# Altium project RFCU_V2.0.PrjPcb
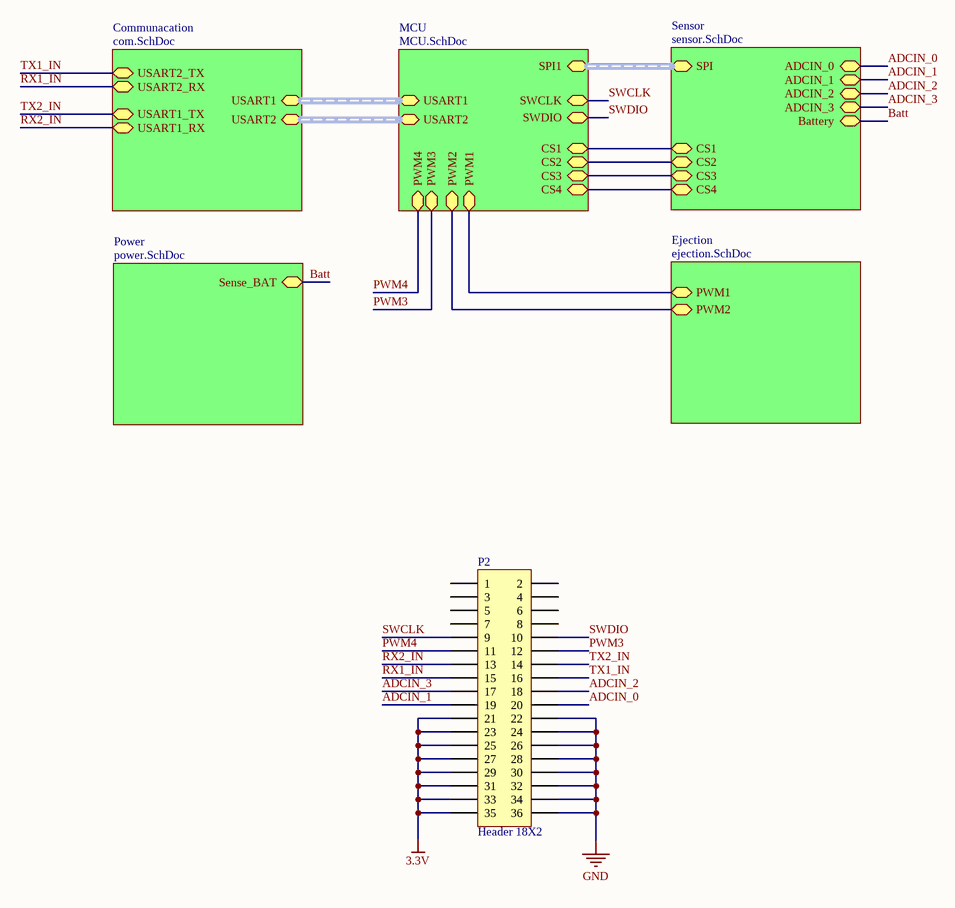
[diagram p0: RFCU_V2.0.SchDoc]
6 sheets, 68 parts. Net scope: hierarchical (ports join the sheet entries above them; power ports are global).
Board file: RCFU_V2.0.PcbDoc
Sheets:
  RFCU_V2.0.SchDoc
    MCU = MCU.SchDoc
    Power = power.SchDoc
    Sensor = sensor.SchDoc
    Communacation = com.SchDoc
    Ejection = ejection.SchDoc

## Sheet RFCU_V2.0.SchDoc
size A4

### Parts
P2  Header 18X2  [2X18 2.54mm Headers]

### Sub-sheets
Communacation = com.SchDoc: USART1 (harness USART), USART2 (harness USART), USART2_RX, USART2_TX, USART1_TX, USART1_RX
Ejection = ejection.SchDoc: PWM2, PWM1
MCU = MCU.SchDoc: USART1 (harness USART), USART2 (harness USART), SPI1 (harness SPI), PWM3, PWM4, PWM2, PWM1, SWCLK, SWDIO, CS4, CS3, CS1, CS2
Power = power.SchDoc: Sense_BAT
Sensor = sensor.SchDoc: SPI (harness SPI), ADCIN_2, ADCIN_1, ADCIN_3, ADCIN_0, Battery, CS2, CS1, CS4, CS3

### Nets
3.3V: P2.21 P2.23 P2.25 P2.27 P2.29 P2.31 P2.33 P2.35  [project net VDD1]
GND: P2.22 P2.24 P2.26 P2.28 P2.30 P2.32 P2.34 P2.36  [project net VSS1]
ADCIN_0: P2.20 ; sheet Sensor/ADCIN_0
ADCIN_1: P2.19 ; sheet Sensor/ADCIN_1
ADCIN_2: P2.18 ; sheet Sensor/ADCIN_2
ADCIN_3: P2.17 ; sheet Sensor/ADCIN_3
Batt: sheet Power/Sense_BAT, sheet Sensor/Battery
CS1: sheet MCU/CS1, sheet Sensor/CS1
CS2: sheet MCU/CS2, sheet Sensor/CS2
CS3: sheet MCU/CS3, sheet Sensor/CS3
CS4: sheet MCU/CS4, sheet Sensor/CS4
PWM3: P2.12 ; sheet MCU/PWM3
PWM4: P2.11 ; sheet MCU/PWM4
RX1_IN: P2.15 ; sheet Communacation/USART2_RX
RX2_IN: P2.13 ; sheet Communacation/USART1_RX
SWCLK: P2.9 ; sheet MCU/SWCLK
SWDIO: P2.10 ; sheet MCU/SWDIO
TX1_IN: P2.16 ; sheet Communacation/USART2_TX
TX2_IN: P2.14 ; sheet Communacation/USART1_TX
NetU1_31: sheet MCU/PWM2, sheet Ejection/PWM2
NetU1_32: sheet MCU/PWM1, sheet Ejection/PWM1

Not connected (* = marked no-connect by the designer): P2 1 2 3 4 5 6 7 8

### Buses and harness runs
harness sheet Communacation/USART1 = sheet MCU/USART1
harness sheet Communacation/USART2 = sheet MCU/USART2
harness sheet MCU/SPI1 = sheet Sensor/SPI

### Library data of the parts
P2 = Header 18X2: Header, 18-Pin, Dual row; LatestRevisionDate: 17-Jul-2002; LatestRevisionNote: Re-released for DXP Platform.; Publisher: Altium Limited

## Sheet MCU.SchDoc
size A4
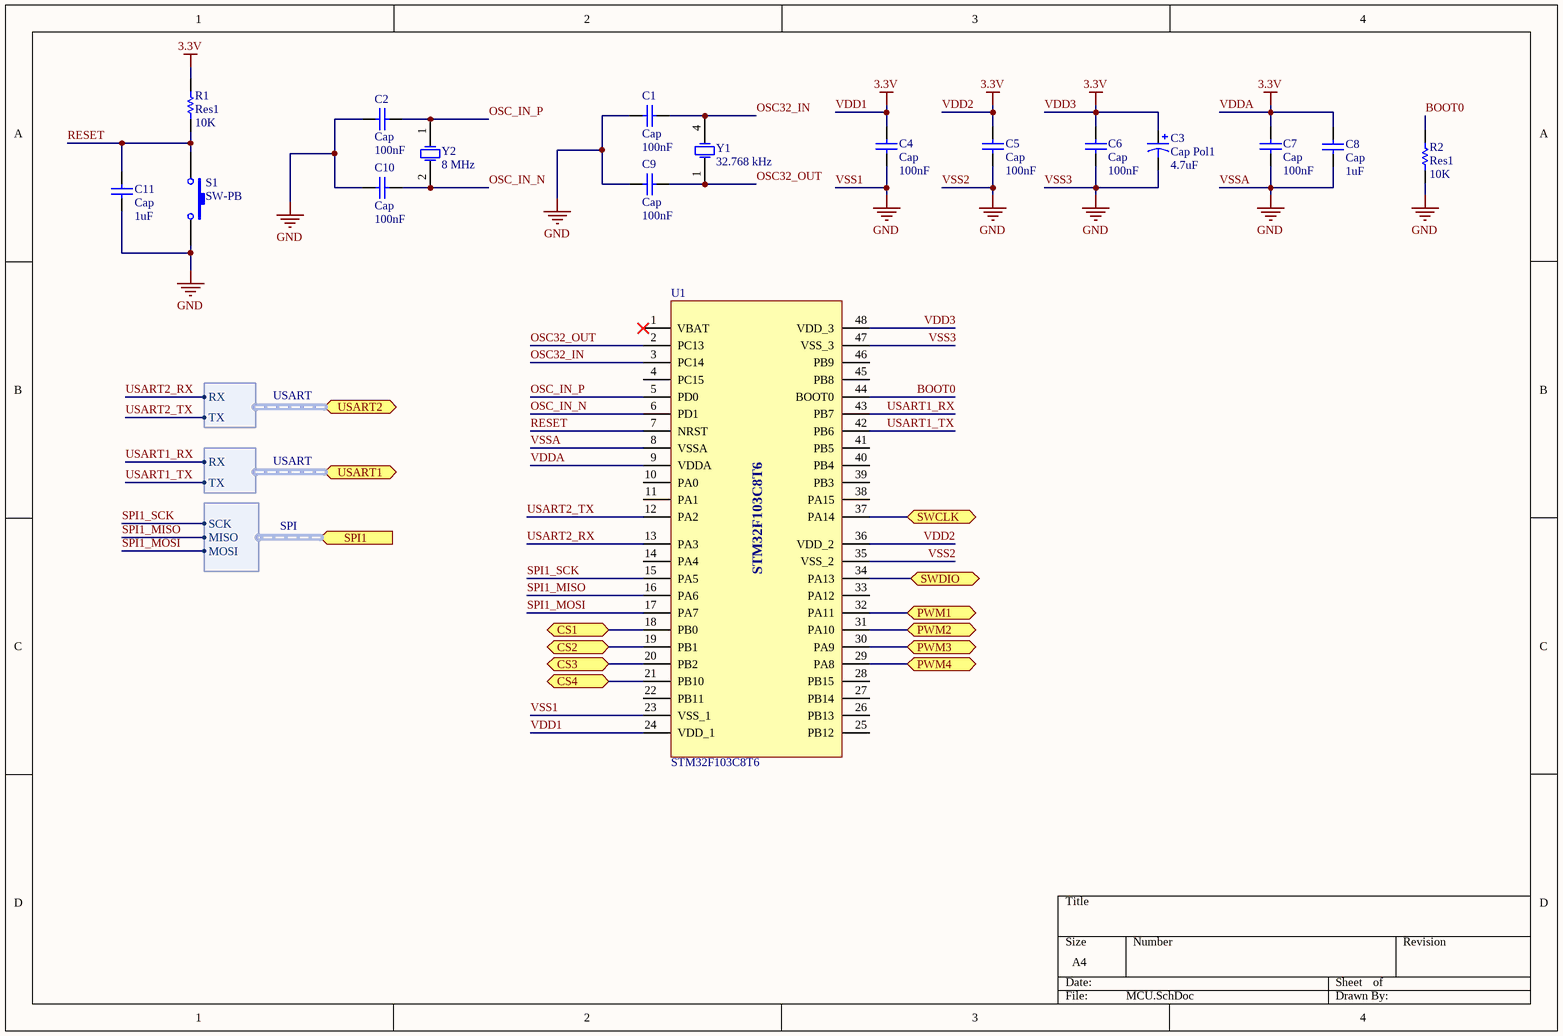
[diagram p1: MCU.SchDoc]

### Parts
C1  Cap  value 100nF  [0805-CAP]
C2  Cap  value 100nF  [0805-CAP]
C3  Cap Pol1  value 4.7uF  [Tantalum A-Case]
C4  Cap  value 100nF  [0805-CAP]
C5  Cap  value 100nF  [0805-CAP]
C6  Cap  value 100nF  [0805-CAP]
C7  Cap  value 100nF  [0805-CAP]
C8  Cap  value 1uF  [0805-CAP]
C9  Cap  value 100nF  [0805-CAP]
C10  Cap  value 100nF  [0805-CAP]
C11  Cap  value 1uF  [0805-CAP]
R1  Res1  value 10K  [0805-RES]
R2  Res1  value 10K  [0805-RES]
S1  SW-PB  [3x6x2.5mm Tacticle Push Button]
U1  STM32F103C8T6  [LQFP-48]
Y1  32.768 kHz  [MC-306 SMD]
Y2  8 MHz  [HC49 Crystal SMD]

### Ports
CS1, CS2, CS3, CS4, PWM1, PWM2, PWM3, PWM4, SPI1 (harness SPI), SWCLK, SWDIO, USART1 (harness USART), USART2 (harness USART)

### Harnesses
USART: TX, RX
SPI: SCK, MISO, MOSI

### Nets
VDD1: C3.1 C4.2 C5.2 C6.2 C7.2 C8.2 R1.2 U1.9(VDDA) U1.24(VDD_1) U1.36(VDD_2) U1.48(VDD_3)  [also labelled 3.3V, VDD2, VDD3, VDDA]
VSS1: C1.2 C2.2 C3.2 C4.1 C5.1 C6.1 C7.1 C8.1 C9.2 C10.2 C11.1 R2.1 S1.2 U1.8(VSSA) U1.23(VSS_1) U1.35(VSS_2) U1.47(VSS_3)  [also labelled GND, VSS2, VSS3, VSSA]
BOOT0: R2.2 U1.44(BOOT0)
CS1: U1.18(PB0) ; port CS1
CS2: U1.19(PB1) ; port CS2
CS3: U1.20(PB2) ; port CS3
CS4: U1.21(PB10) ; port CS4
OSC32_IN: C1.1 U1.3(PC14) Y1.4(OSC2)
OSC32_OUT: C9.1 U1.2(PC13) Y1.1(OSC1)
OSC_IN_N: C10.1 U1.6(PD1) Y2.2(OSC2)
OSC_IN_P: C2.1 U1.5(PD0) Y2.1(OSC1)
PWM3: U1.30(PA9) ; port PWM3
PWM4: U1.29(PA8) ; port PWM4
RESET: C11.2 R1.1 S1.1 U1.7(NRST)
SPI1_MISO: U1.16(PA6) ; port SPI1.MISO  [project net MISO]
SPI1_MOSI: U1.17(PA7) ; port SPI1.MOSI  [project net MOSI]
SPI1_SCK: U1.15(PA5) ; port SPI1.SCK  [project net SCK]
SWCLK: U1.37(PA14) ; port SWCLK
SWDIO: U1.34(PA13) ; port SWDIO
USART1_RX: U1.43(PB7) ; port USART1.RX  [project net RX2_IN]
USART1_TX: U1.42(PB6) ; port USART1.TX  [project net TX2_IN]
USART2_RX: U1.13(PA3) ; port USART2.RX  [project net RX1_IN]
USART2_TX: U1.12(PA2) ; port USART2.TX  [project net TX1_IN]
NetU1_31: U1.31(PA10) ; port PWM2
NetU1_32: U1.32(PA11) ; port PWM1

Not connected (* = marked no-connect by the designer): U1 1(VBAT)* 4(PC15) 10(PA0) 11(PA1) 14(PA4) 22(PB11) 25(PB12) 26(PB13) 27(PB14) 28(PB15) 33(PA12) 38(PA15) 39(PB3) 40(PB4) 41(PB5) 45(PB8) 46(PB9)

### Library data of the parts
C1 C2 C4-C11 = Cap: Capacitor; Published: 8-Jun-2000; LatestRevisionDate: 17-Jul-2002; LatestRevisionNote: Re-released for DXP Platform.; PackageReference: RAD-0.3; Publisher: Altium Limited; PackageDescription: Radial Cap, Thru-Hole; 2 Leads; 0.3 in Pin Spacing
C3 = Cap Pol1: Polarized Capacitor (Radial); Published: 8-Jun-2000; LatestRevisionDate: 17-Jul-2002; LatestRevisionNote: Re-released for DXP Platform.; PackageReference: RB7.6-15; Publisher: Altium Limited; PackageDescription: Polarized Capacitor (Radial); 2 Leads
R1 R2 = Res1: Resistor; Published: 8-Jun-2000; LatestRevisionDate: 17-Jul-2002; LatestRevisionNote: Re-released for DXP Platform.; PackageReference: AXIAL-0.3; Publisher: Altium Limited; PackageDescription: Axial Device, Thru-Hole; 2 Leads; 0.3 in Pin Spacing
S1 = SW-PB: Switch; Published: 24-Mar-1999; LatestRevisionDate: 17-Jul-2002; LatestRevisionNote: Re-released for DXP Platform.; PackageReference: SPST-2; Publisher: Altium Limited; PackageDescription: Switch; 2 Leads
U1 = STM32F103C8T6-LQPF48: STM32F103C8T6 LQPF-48
Y1 Y2 = XTAL: Crystal Oscillator; Published: 8-Jun-2000; LatestRevisionDate: 17-Jul-2002; LatestRevisionNote: Re-released for DXP Platform.; PackageReference: R38; Publisher: Altium Limited; PackageDescription: Crystal, Thru-Hole; 2 Leads; Body 3.1 x 8.2 mm (Dia.xH)

## Sheet power.SchDoc
size A4
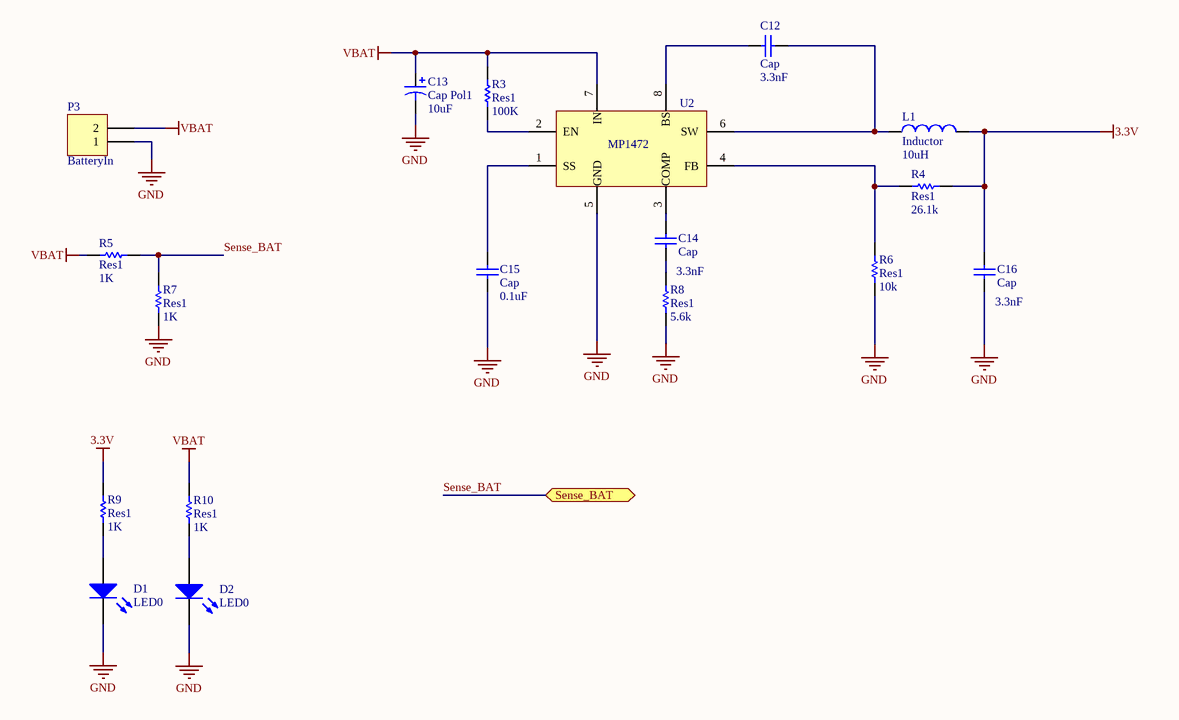
[diagram p2: power.SchDoc]

### Parts
C12  Cap  value 3.3nF  [0805-CAP]
C13  Cap Pol1  value 10uF  [Tantalum A-Case]
C14  Cap  value 3.3nF  [0805-CAP]
C15  Cap  value 0.1uF  [0805-CAP]
C16  Cap  value 3.3nF  [0805-CAP]
D1  LED0  [1206-LED RED]
D2  LED0  [1206-LED RED]
L1  Inductor  value 10uH  [DR125]
P3  BatteryIn  [Battery 1]
R3  Res1  value 100K  [0805-RES]
R4  Res1  value 26.1k  [0805-RES]
R5  Res1  value 1K  [0805-RES]
R6  Res1  value 10k  [0805-RES]
R7  Res1  value 1K  [0805-RES]
R8  Res1  value 5.6k  [0805-RES]
R9  Res1  value 1K  [0805-RES]
R10  Res1  value 1K  [0805-RES]
U2  MP1472  [TSOP-23]

### Ports
Sense_BAT

### Nets
3.3V: C16.1 L1.2 R4.2 R9.2  [project net VDD1]
GND: C13.2 C15.2 C16.2 D1.2(K) D2.2(K) P3.1 R6.1 R7.2 R8.2 U2.5(GND)  [project net VSS1]
VBAT: C13.1 P3.2 R3.1 R5.1 R10.2 U2.7(IN)  [project net LoadIN]
Sense_BAT: R5.2 R7.1 ; port Sense_BAT  [project net Batt]
NetC12_1: C12.1 U2.8(BS)
NetC12_2: C12.2 L1.1 U2.6(SW)
NetC14_1: C14.1 U2.3(COMP)
NetC14_2: C14.2 R8.1
NetC15_1: C15.1 U2.1(SS)
NetD1_1: D1.1(A) R9.1
NetD2_1: D2.1(A) R10.1
NetR3_2: R3.2 U2.2(EN)
NetR4_1: R4.1 R6.2 U2.4(FB)

### Library data of the parts
C12 C14-C16 = Cap: Capacitor; Published: 8-Jun-2000; LatestRevisionDate: 17-Jul-2002; LatestRevisionNote: Re-released for DXP Platform.; PackageReference: RAD-0.3; Publisher: Altium Limited; PackageDescription: Radial Cap, Thru-Hole; 2 Leads; 0.3 in Pin Spacing
C13 = Cap Pol1: Polarized Capacitor (Radial); Published: 8-Jun-2000; LatestRevisionDate: 17-Jul-2002; LatestRevisionNote: Re-released for DXP Platform.; PackageReference: RB7.6-15; Publisher: Altium Limited; PackageDescription: Polarized Capacitor (Radial); 2 Leads
D1 D2 = LED0: Typical INFRARED GaAs LED; Published: 8-Jun-2000; LatestRevisionDate: 08-Jul-2005; LatestRevisionNote: Mech Layer 1 removed.; PackageReference: LED-0; Publisher: Altium Limited; PackageDescription: LED; 2 Leads
L1 = Inductor: Code_IEC: 1005; Published: 8-Jun-2000; LatestRevisionDate: 29-May-2009; LatestRevisionNote: IPC-7351 Footprint Added.; PackageReference: 0402-A; Publisher: Altium Limited; PackageDescription: Chip Inductor; Code_JEITA: 0402
P3 = Header 2: Header, 2-Pin; LatestRevisionDate: 17-Jul-2002; LatestRevisionNote: Re-released for DXP Platform.; Publisher: Altium Limited
R3-R10 = Res1: Resistor; Published: 8-Jun-2000; LatestRevisionDate: 17-Jul-2002; LatestRevisionNote: Re-released for DXP Platform.; PackageReference: AXIAL-0.3; Publisher: Altium Limited; PackageDescription: Axial Device, Thru-Hole; 2 Leads; 0.3 in Pin Spacing
U2 = MP1472: MP1472 2A 18V Step-Down Conventor

## Sheet sensor.SchDoc
size A4
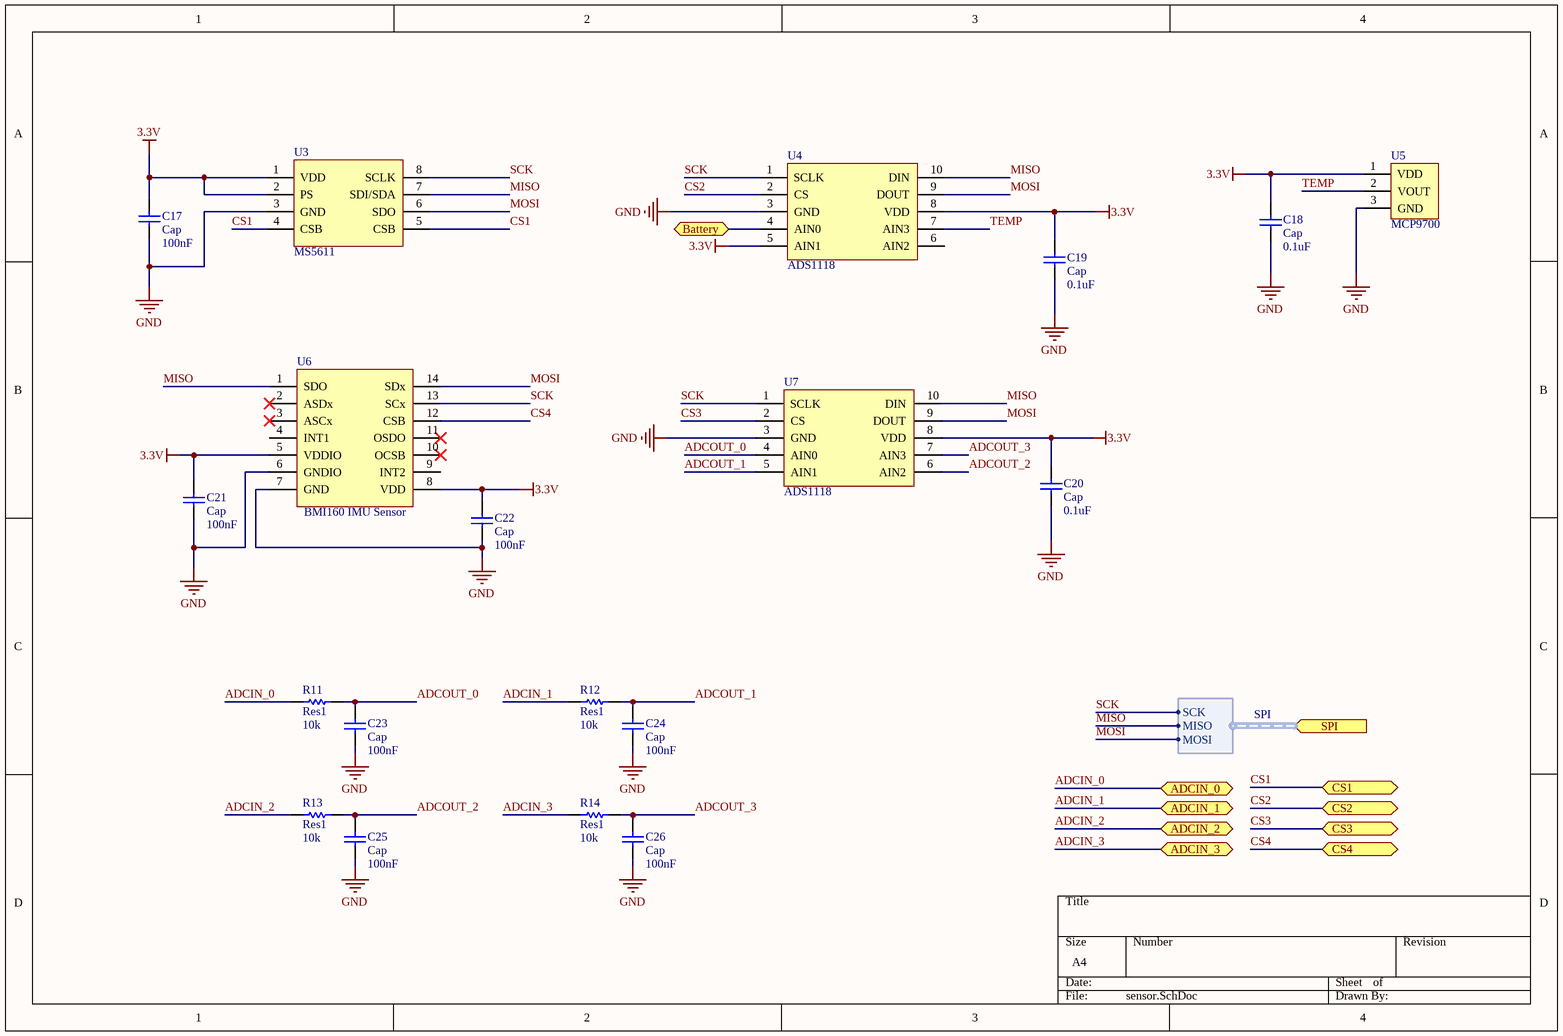
[diagram p3: sensor.SchDoc]

### Parts
C17  Cap  value 100nF  [0805-CAP]
C18  Cap  value 0.1uF  [0805-CAP]
C19  Cap  value 0.1uF  [0805-CAP]
C20  Cap  value 0.1uF  [0805-CAP]
C21  Cap  value 100nF  [0805-CAP]
C22  Cap  value 100nF  [0805-CAP]
C23  Cap  value 100nF  [0805-CAP]
C24  Cap  value 100nF  [0805-CAP]
C25  Cap  value 100nF  [0805-CAP]
C26  Cap  value 100nF  [0805-CAP]
R11  Res1  value 10k  [0805-RES]
R12  Res1  value 10k  [0805-RES]
R13  Res1  value 10k  [0805-RES]
R14  Res1  value 10k  [0805-RES]
U3  MS5611  [MS5611-01BA03]
U4  ADS1118  [MSOP10]
U5  MCP9700  [SOT23-3 (TO-236AB)]
U6  BMI160 IMU Sensor  [BMI160]
U7  ADS1118  [MSOP10]

### Ports
ADCIN_0, ADCIN_1, ADCIN_2, ADCIN_3, Battery, CS1, CS2, CS3, CS4, SPI (harness SPI)

### Harnesses
SPI: SCK, MISO, MOSI

### Nets
3.3V: C17.1 C18.1 C19.1 C20.1 C21.1 C22.1 U3.1(VDD) U3.2(PS) U4.5(AIN1) U4.8(VDD) U5.1(VDD) U6.5(VDDIO) U6.8(VDD) U7.8(VDD)  [project net VDD1]
GND: C17.2 C18.2 C19.2 C20.2 C21.2 C22.2 C23.2 C24.2 C25.2 C26.2 U3.3(GND) U4.3(GND) U5.3(GND) U6.6(GNDIO) U6.7(GND) U7.3(GND)  [project net VSS1]
ADCIN_0: R11.1 ; port ADCIN_0
ADCIN_1: R12.1 ; port ADCIN_1
ADCIN_2: R13.1 ; port ADCIN_2
ADCIN_3: R14.1 ; port ADCIN_3
ADCOUT_0: C23.1 R11.2 U7.4(AIN0)
ADCOUT_1: C24.1 R12.2 U7.5(AIN1)
ADCOUT_2: C25.1 R13.2 U7.6(AIN2)
ADCOUT_3: C26.1 R14.2 U7.7(AIN3)
Batt: U4.4(AIN0) ; port Battery
CS1: U3.4(CSB) U3.5(CSB) ; port CS1
CS2: U4.2(CS) ; port CS2
CS3: U7.2(CS) ; port CS3
CS4: U6.12(CSB) ; port CS4
MISO: U3.7(SDI/SDA) U4.10(DIN) U6.1(SDO) U7.10(DIN) ; port SPI.MISO
MOSI: U3.6(SDO) U4.9(DOUT) U6.14(SDx) U7.9(DOUT) ; port SPI.MOSI
SCK: U3.8(SCLK) U4.1(SCLK) U6.13(SCx) U7.1(SCLK) ; port SPI.SCK
TEMP: U4.7(AIN3) U5.2(VOUT)

Not connected (* = marked no-connect by the designer): U4 6(AIN2); U6 2(ASDx)* 3(ASCx)* 4(INT1) 9(INT2) 10(OCSB)* 11(OSDO)*

### Library data of the parts
C17-C26 = Cap: Capacitor; Published: 8-Jun-2000; LatestRevisionDate: 17-Jul-2002; LatestRevisionNote: Re-released for DXP Platform.; PackageReference: RAD-0.3; Publisher: Altium Limited; PackageDescription: Radial Cap, Thru-Hole; 2 Leads; 0.3 in Pin Spacing
R11-R14 = Res1: Resistor; Published: 8-Jun-2000; LatestRevisionDate: 17-Jul-2002; LatestRevisionNote: Re-released for DXP Platform.; PackageReference: AXIAL-0.3; Publisher: Altium Limited; PackageDescription: Axial Device, Thru-Hole; 2 Leads; 0.3 in Pin Spacing
U3 = MS5611: MS5611 Barometer I2C/SPI
U4 U7 = ADS1118: ADS1118 SPI 4 Channel ADC
U5 = MCP9700: MCP9700 Linear Temperature Sensor
U6 = BMI160 IMU Sensor: BoschTech BMI160 6 Axis IMU Sensor

## Sheet com.SchDoc
size A4
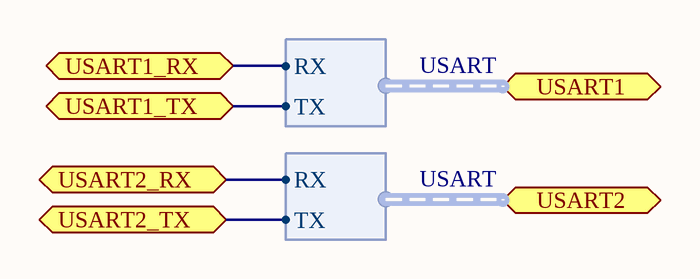
[diagram p4: com.SchDoc]

### Ports
USART1 (harness USART), USART1_RX, USART1_TX, USART2 (harness USART), USART2_RX, USART2_TX

### Harnesses
USART: TX, RX

### Nets
RX1_IN: port USART2_RX, port USART2.RX
RX2_IN: port USART1_RX, port USART1.RX
TX1_IN: port USART2_TX, port USART2.TX
TX2_IN: port USART1_TX, port USART1.TX

## Sheet ejection.SchDoc
size A
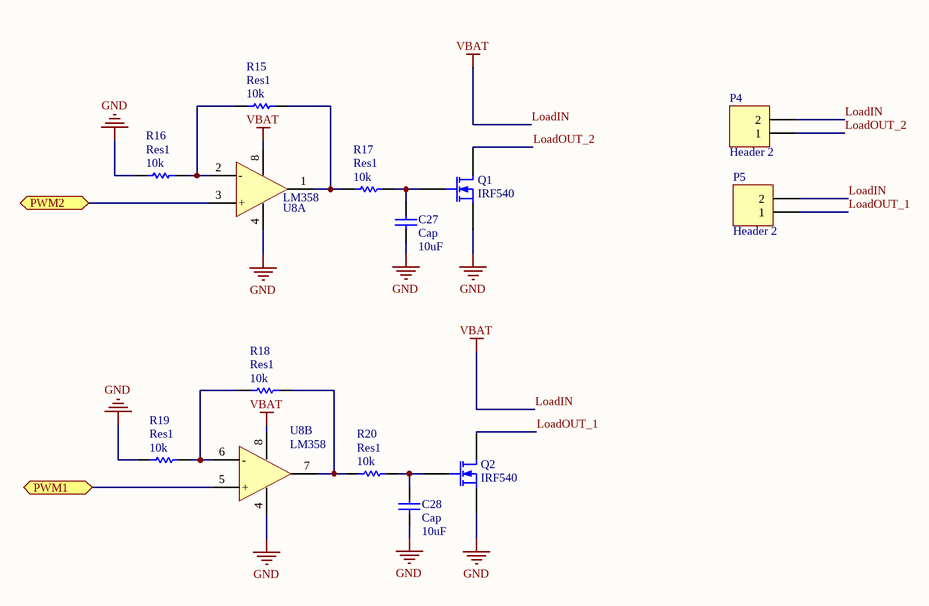
[diagram p5: ejection.SchDoc]

### Parts
C27  Cap  value 10uF  [0805-CAP]
C28  Cap  value 10uF  [0805-CAP]
P4  Header 2  [Battery 2]
P5  Header 2  [Battery 2]
Q1  IRF540  [TO-263-AA]
Q2  IRF540  [TO-263-AA]
R15  Res1  value 10k  [0805-RES]
R16  Res1  value 10k  [0805-RES]
R17  Res1  value 10k  [0805-RES]
R18  Res1  value 10k  [0805-RES]
R19  Res1  value 10k  [0805-RES]
R20  Res1  value 10k  [0805-RES]
U8  LM358  [SOIC-8]  (parts A,B of 2)

### Ports
PWM1, PWM2

### Nets
GND: C27.1 C28.1 Q1.3(S) Q2.3(S) R16.1 R19.1 U8.4(VCC-)  [project net VSS1]
LoadIN: P4.2 P5.2 U8.8(VCC+)  [also labelled VBAT]
LoadOUT_1: P5.1 Q2.1(D)
LoadOUT_2: P4.1 Q1.1(D)
NetC27_2: C27.2 Q1.2(G) R17.2
NetC28_2: C28.2 Q2.2(G) R20.2
NetR15_1: R15.1 R16.2 U8.2(-)
NetR15_2: R15.2 R17.1 U8.1(OUT)
NetR18_1: R18.1 R19.2 U8.6(-)
NetR18_2: R18.2 R20.1 U8.7(OUT)
NetU1_31: U8.3(+) ; port PWM2
NetU1_32: U8.5(+) ; port PWM1

### Library data of the parts
C27 C28 = Cap: Capacitor; Published: 8-Jun-2000; LatestRevisionDate: 17-Jul-2002; LatestRevisionNote: Re-released for DXP Platform.; PackageReference: RAD-0.3; Publisher: Altium Limited; PackageDescription: Radial Cap, Thru-Hole; 2 Leads; 0.3 in Pin Spacing
P4 P5 = Header 2: Header, 2-Pin; LatestRevisionDate: 17-Jul-2002; LatestRevisionNote: Re-released for DXP Platform.; Publisher: Altium Limited
Q1 Q2 = MOSFET-N: N-Channel MOSFET; Published: 8-Jun-2000; LatestRevisionDate: 17-Jul-2002; LatestRevisionNote: Re-released for DXP Platform.; PackageVersion: 1995/1996; PackageReference: E3; Publisher: Altium Limited; PackageDescription: TO, Flat Index; 3 In-Line, Axial Leads; Body Dia. 4.6mm; Lead Dia. 0.5 mm (max)
R15-R20 = Res1: Resistor; Published: 8-Jun-2000; LatestRevisionDate: 17-Jul-2002; LatestRevisionNote: Re-released for DXP Platform.; PackageReference: AXIAL-0.3; Publisher: Altium Limited; PackageDescription: Axial Device, Thru-Hole; 2 Leads; 0.3 in Pin Spacing
U8 = LM358: LM358 OPAMP

## Nets that join several sheets
LoadIN: power (6 pins), ejection (P4.2 P5.2 U8.8)
VDD1: RFCU_V2.0 (8 pins), MCU (11 pins), power (C16.1 L1.2 R4.2 R9.2), sensor (14 pins)
VSS1: RFCU_V2.0 (8 pins), MCU (17 pins), power (10 pins), sensor (16 pins), ejection (7 pins)
ADCIN_0: RFCU_V2.0 (P2.20), sensor (R11.1)
ADCIN_1: RFCU_V2.0 (P2.19), sensor (R12.1)
ADCIN_2: RFCU_V2.0 (P2.18), sensor (R13.1)
ADCIN_3: RFCU_V2.0 (P2.17), sensor (R14.1)
Batt: power (R5.2 R7.1), sensor (U4.4)
CS1: MCU (U1.18), sensor (U3.4 U3.5)
CS2: MCU (U1.19), sensor (U4.2)
CS3: MCU (U1.20), sensor (U7.2)
CS4: MCU (U1.21), sensor (U6.12)
MISO: MCU (U1.16), sensor (U3.7 U4.10 U6.1 U7.10)
MOSI: MCU (U1.17), sensor (U3.6 U4.9 U6.14 U7.9)
NetU1_31: MCU (U1.31), ejection (U8.3)
NetU1_32: MCU (U1.32), ejection (U8.5)
PWM3: RFCU_V2.0 (P2.12), MCU (U1.30)
PWM4: RFCU_V2.0 (P2.11), MCU (U1.29)
RX1_IN: RFCU_V2.0 (P2.15), MCU (U1.13)
RX2_IN: RFCU_V2.0 (P2.13), MCU (U1.43)
SCK: MCU (U1.15), sensor (U3.8 U4.1 U6.13 U7.1)
SWCLK: RFCU_V2.0 (P2.9), MCU (U1.37)
SWDIO: RFCU_V2.0 (P2.10), MCU (U1.34)
TX1_IN: RFCU_V2.0 (P2.16), MCU (U1.12)
TX2_IN: RFCU_V2.0 (P2.14), MCU (U1.42)